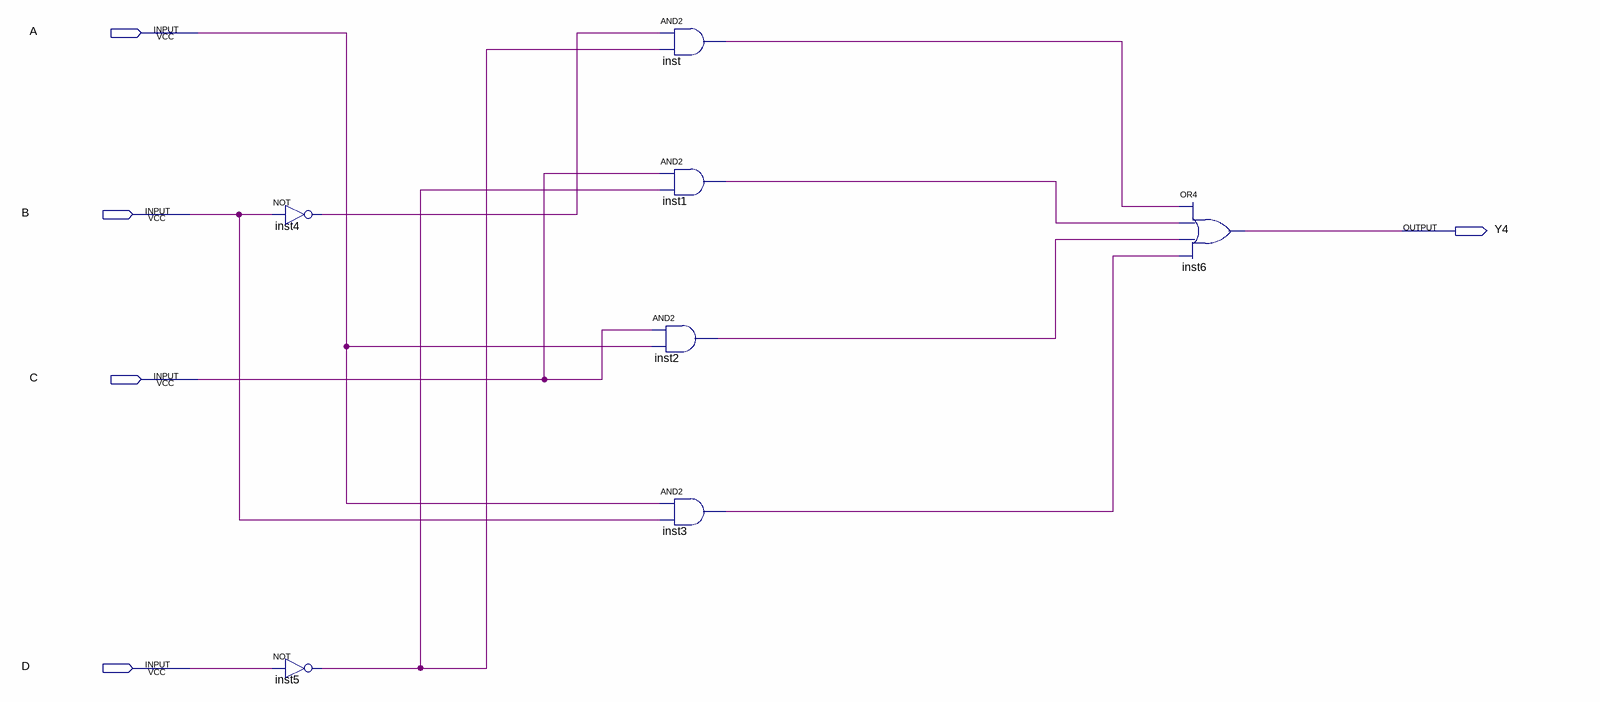
[diagram p0: schematic sheet]
// Quartus schematic four.bdf as structural Verilog: 7 symbols, 5 pins
module four (
  input  A,
  input  B,
  input  C,
  input  D,
  output Y4
);

  wire inst1_out, inst2_out, inst3_out, inst4_out, inst5_out, inst_out;

  not inst4 (inst4_out, B);
  not inst5 (inst5_out, D);
  and inst (inst_out, inst4_out, inst5_out);
  and inst1 (inst1_out, C, inst5_out);
  and inst2 (inst2_out, C, A);
  and inst3 (inst3_out, A, B);
  or inst6 (Y4, inst_out, inst1_out, inst2_out, inst3_out);
endmodule
